# Altium schematic sheet MAX_M8Q_Avionics_Board.SchDoc: MAX_M8Q Avionics Board
size A4; Author: Adam R. Lehman; SheetNumber: 5; SheetTotal: 5
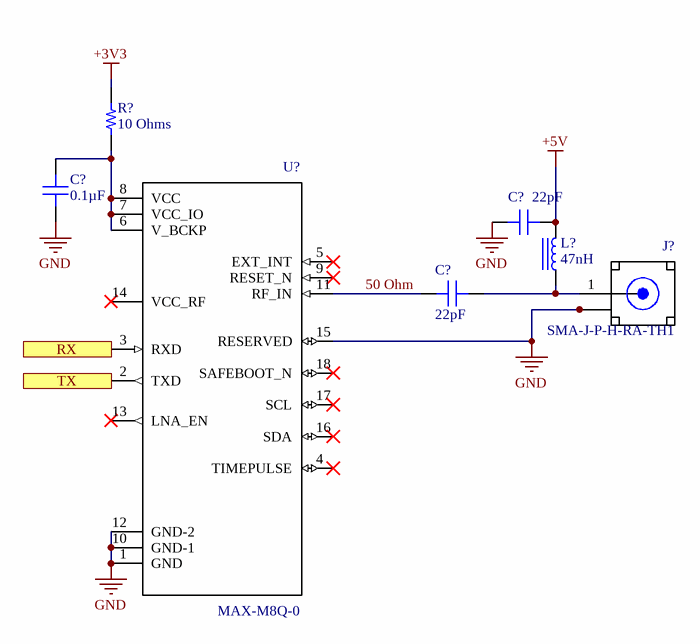
[diagram p0: MAX_M8Q_Avionics_Board.SchDoc]

## Parts
(Parts that share a designator on the sheet are numbered #1, #2 ... from top to bottom, then left to right.)
C?#1  0.1µF  [CAP 0603_1608]
C?#2  22pF  [CAP 0603_1608]
C?#3  22pF  [CAP 0603_1608]
J?  SMA-J-P-H-RA-TH1  [*SAMTEC_SMA-J-P-H-RA-TH1]
L?  47nH  [IND 0402_1005 RF WW]
R?  10 Ohms  [RES 0603_1608]
U?  MAX-M8Q-0  [*XCVR_MAX-M8C-0-10]

## Ports
RX, TX

## Nets
+3V3: R?.2
+5V: C?#2.2 L?.2
GND: C?#1.1 C?#2.1 J?.2(GND) J?.3(GND) J?.4(GND) J?.5(GND) U?.1(GND) U?.10(GND-1) U?.12(GND-2) U?.15(RESERVED)
50 Ohm: C?#3.2 U?.11(RF_IN)
RX: U?.3(RXD) ; port RX
TX: U?.2(TXD) ; port TX
NetC?#1_2: C?#1.2 R?.1 U?.6(V_BCKP) U?.7(VCC_IO) U?.8(VCC)
NetC?#3_1: C?#3.1 J?.1(SIGNAL) L?.1

Not connected (* = marked no-connect by the designer): U? 4(TIMEPULSE)* 5(EXT_INT)* 9(RESET_N)* 13(LNA_EN)* 14(VCC_RF)* 16(SDA)* 17(SCL)* 18(SAFEBOOT_N)*

## Notes on the sheet
- Title
- Size:
- Date:
- A4
- Author
- Time:
- Sheet
- Revision:
- of
- RIT Space Exploration Team
- Rochester Institute of Technology
- 1 Lomb Memorial Drive
- Rochester, NY 14623
- https://spex.rit.edu
- File:

## Library data of the parts
C?#1 = 100X14W104MV4T: CAP CER 0.1UF 10V X7R 0603; Manufacturer: Johanson Dielectrics Inc.; Tolerance: ±20%; Part Number: 100X14W104MV4T; Value: 0.1µF; Applications: Bypass, Decoupling; Capacitance: 0.1µF; ComponentLink1Description: Datasheet; ComponentLink1URL: https://www.johansondielectrics.com/downloads/x2y-filter-and-decoupling-capacitors.pdf; ComponentLink2Description: DigiKey Link; ComponentLink2URL: http://digikey.com/product-detail/en/johanson-dielectrics-inc/100X14W104MV4T/709-1101-1-ND/1655915; Device Package: 0603 (1608 Metric); Features: Low ESL (X2Y); LastUpdated: 1/21/2020 12:02:09 AM; Lifecycle Status: Active; Minimum Order: 1; Mounting Type: Surface Mount, MLCC; Operating Temperature: -55°C ~ 125°C; Package / Case: 0603 (1608 Metric); Packaging: TapeAndReel; PartId: 2680; Part Status: Active; Price: 0.11; Series: X2Y®; Size / Dimension: 0.064" L x 0.035" W (1.63mm x 0.89mm); Supplier 1: DigiKey; Supplier Part Number 1: 709-1101-1-ND; Temperature Coefficient: X7R; Thickness (Max): 0.026" (0.66mm); Voltage - Rated: 10V
C?#2 C?#3 = C0603C220J5GACTU: CAP CER 22PF 50V C0G/NP0 0603; Manufacturer: KEMET; Temperature Coefficient: C0G, NP0; Tolerance: ±5%; Part Number: C0603C220J5GACTU; Value: 22pF; Applications: General Purpose; Capacitance: 22pF; ComponentLink1Description: Datasheet; ComponentLink1URL: https://api.kemet.com/component-edge/download/datasheet/C0603C220J5GACTU.pdf; ComponentLink2Description: DigiKey Link; ComponentLink2URL: http://digikey.com/product-detail/en/kemet/C0603C220J5GACTU/399-1053-1-ND/411328; Device Package: 0603 (1608 Metric); Features: Low ESL; LastUpdated: 1/21/2020 12:02:09 AM; Lifecycle Status: Active; Minimum Order: 1; Mounting Type: Surface Mount, MLCC; Operating Temperature: -55°C ~ 125°C; Package / Case: 0603 (1608 Metric); Packaging: TapeAndReel; PartId: 2302; Part Status: Active; Price: 0.02; Series: SMD Comm C0G; Size / Dimension: 0.063" L x 0.031" W (1.60mm x 0.80mm); Supplier 1: DigiKey; Supplier Part Number 1: 399-1053-1-ND; Thickness (Max): 0.034" (0.87mm); Voltage - Rated: 50V
L? = LQW15AN47NG00D: FIXED IND 47NH 210MA 1.08 OHM; Manufacturer: Murata Electronics; DC Resistance (DCR): 1.08Ohm Max; Frequency - Self Resonant: 2.9GHz; Inductance Frequency - Test: 100MHz; Material - Core: Non-Magnetic; Q @ Freq: 25 @ 200MHz; Shielding: Unshielded; Tolerance: ±2%; Type: Wirewound; Part Number: LQW15AN47NG00D; ComponentLink1Description: Datasheet; ComponentLink1URL: https://search.murata.co.jp/Ceramy/image/img/P02/JELF243A-0050.pdf; ComponentLink2Description: DigiKey Link; ComponentLink2URL: http://digikey.com/product-detail/en/murata-electronics/LQW15AN47NG00D/490-6819-1-ND/3846016; Current Rating (Amps): 210mA; Device Package: 0402 (1005 Metric); Height - Seated (Max): 0.024" (0.60mm); Inductance: 47nH; LastUpdated: 1/21/2020 3:29:00 AM; Lifecycle Status: Active; Minimum Order: 1; Mounting Type: Surface Mount; Operating Temperature: -55°C ~ 125°C; Package / Case: 0402 (1005 Metric); Packaging: TapeAndReel; PartId: 306; Part Status: Active; Price: 0.05; Series: LQW15; Size / Dimension: 0.039" L x 0.020" W (1.00mm x 0.50mm); Supplier 1: DigiKey; Supplier Part Number 1: 490-6819-1-ND; Value: 47nH
R? = SG731JTTD100K: SMD RESISTOR; Manufacturer: KOA Speer Electronics, Inc.; Power (Watts): 0.1W, 1/10W; Temperature Coefficient: ±200ppm/°C; Tolerance: ±10%; Part Number: SG731JTTD100K; Value: 10 Ohms; ComponentLink1Description: Datasheet; ComponentLink1URL: http://www.koaspeer.com/catimages/Products/SG73/SG73.pdf; ComponentLink2Description: DigiKey Link; ComponentLink2URL: http://digikey.com/product-detail/en/koa-speer-electronics-inc/SG731JTTD100K/2019-SG731JTTD100KCT-ND/10187255; Composition: Thick Film; Device Package: 0603 (1608 Metric); Features: Automotive AEC-Q200, Moisture Resistant, Pulse Withstanding; Height - Seated (Max): 0.022" (0.55mm); LastUpdated: 1/21/2020 12:19:43 AM; Lifecycle Status: Active; Minimum Order: 1; Number of Terminations: 2; Operating Temperature: -55°C ~ 155°C; Package / Case: 0603 (1608 Metric); Packaging: TapeAndReel; PartId: 17783; Part Status: Active; Price: 0.02; Ratings: AEC-Q200; Resistance: 10 Ohms; Series: SG73; Size / Dimension: 0.063" L x 0.031" W (1.60mm x 0.80mm); Supplier 1: DigiKey; Supplier Part Number 1: 2019-SG731JTTD100KCT-ND; Supplier Device Package: 0603
J? = SMA-J-P-H-RA-TH1: SnapEDA_Link: https://www.snapeda.com/parts/SMA-J-P-H-RA-TH1/Samtec%20Inc./view-part/134498/?ref=snap; Value: *
U? = MAX-M8Q-0: Value: *